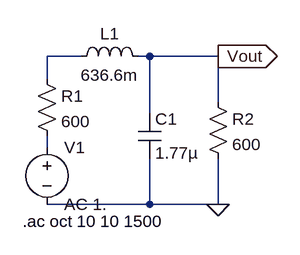
[diagram p0: schematic lowpass.asc]
lowpass.asc, the LTspice schematic file:
Version 4
SHEET 1 880 680
WIRE 128 64 80 64
WIRE 224 64 208 64
WIRE 320 64 224 64
WIRE 80 96 80 64
WIRE 320 128 320 64
WIRE 224 144 224 64
WIRE 80 192 80 176
WIRE 224 272 224 208
WIRE 224 272 80 272
WIRE 320 272 320 208
WIRE 320 272 224 272
FLAG 320 272 0
FLAG 320 64 Vout
IOPIN 320 64 Out
SYMBOL voltage 80 176 R0
SYMATTR InstName V1
SYMATTR Value AC 1.
SYMBOL res 64 80 R0
SYMATTR InstName R1
SYMATTR Value 600
SYMBOL res 304 112 R0
SYMATTR InstName R2
SYMATTR Value 600
SYMBOL ind 112 80 R270
WINDOW 0 32 56 VTop 2
WINDOW 3 5 56 VBottom 2
SYMATTR InstName L1
SYMATTR Value 636.6m
SYMBOL cap 208 144 R0
SYMATTR InstName C1
SYMATTR Value 1.77µ
TEXT 46 296 Left 2 !.ac oct 10 10 1500

The netlist it stands for:
* lowpass.asc
V1 N002 0 AC 1.
R1 N001 N002 600
R2 Vout 0 600
L1 N001 Vout 636.6m
C1 Vout 0 1.77µ
.ac oct 10 10 1500
.backanno
.end